# EAGLE design rony_4_buttons (EAGLE 8.2.0)
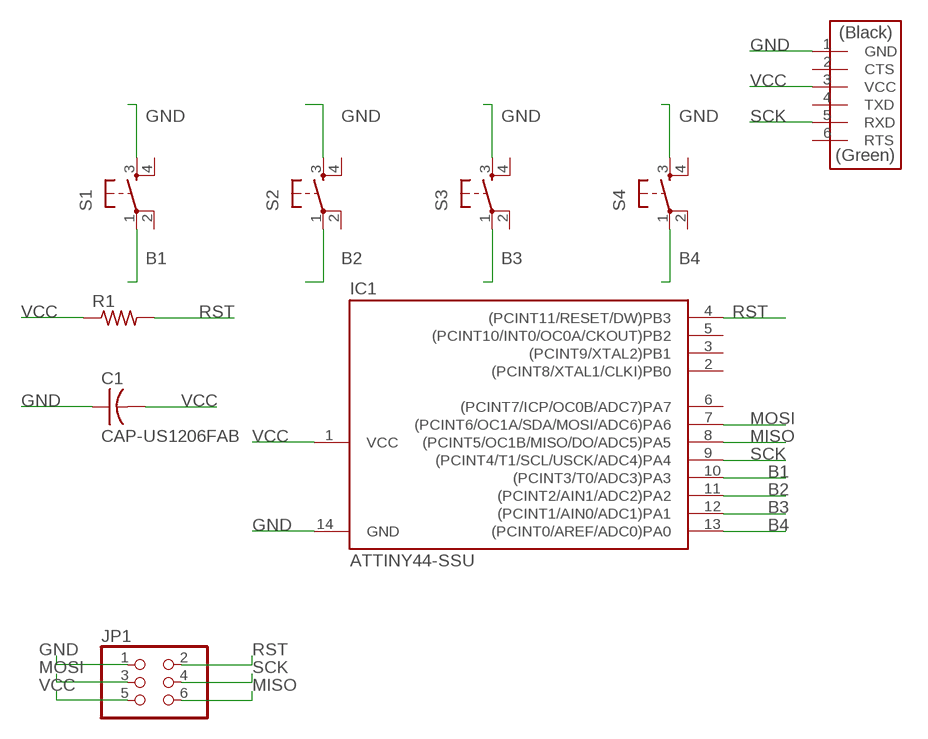
[diagram p0: schematic, sheet 1]

## Parts
C1  CAP-US1206FAB  [C1206FAB]
IC1  ATTINY44-SSU  [SOIC14]
JP1  PINHD-2X3-SMD  [2X03SMD]
R1  RES-US1206FAB  [R1206FAB]
S1  6MM_SWITCH6MM_SWITCH  [6MM_SWITCH]
S2  6MM_SWITCH6MM_SWITCH  [6MM_SWITCH]
S3  6MM_SWITCH6MM_SWITCH  [6MM_SWITCH]
S4  6MM_SWITCH6MM_SWITCH  [6MM_SWITCH]
U$1  FTDI-SMD-HEADER  [1X06SMD]

## Nets
B1: IC1.10((PCINT3/T0/ADC3)PA3) S1.1(P)
B2: IC1.11((PCINT2/AIN1/ADC2)PA2) S2.1(P)
B3: IC1.12((PCINT1/AIN0/ADC1)PA1) S3.1(P)
B4: IC1.13((PCINT0/AREF/ADC0)PA0) S4.1(P)
GND: C1.1 IC1.14(GND) JP1.1 S1.3(S) S2.3(S) S3.3(S) S4.3(S) U$1.1(GND)
MISO: IC1.8((PCINT5/OC1B/MISO/DO/ADC5)PA5) JP1.6
MOSI: IC1.7((PCINT6/OC1A/SDA/MOSI/ADC6)PA6) JP1.3
RST: IC1.4((PCINT11/RESET/DW)PB3) JP1.2 R1.2
SCK: IC1.9((PCINT4/T1/SCL/USCK/ADC4)PA4) JP1.4 U$1.5(RXD)
VCC: C1.2 IC1.1(VCC) JP1.5 R1.1 U$1.3(VCC)
Unconnected: IC1.2((PCINT8/XTAL1/CLKI)PB0) IC1.3((PCINT9/XTAL2)PB1) IC1.5((PCINT10/INT0/OC0A/CKOUT)PB2) IC1.6((PCINT7/ICP/OC0B/ADC7)PA7) S1.2(P1) S1.4(S1) S2.2(P1) S2.4(S1) S3.2(P1) S3.4(S1) S4.2(P1) S4.4(S1) U$1.2(CTS) U$1.4(TXD) U$1.6(RTS)

## Library data of the parts
C1 = fab:CAP-US
IC1 = fab:ATTINY44
JP1 = fab:PINHD-2X3-SMD: PIN HEADER
R1 = fab:RES-US: Resistor (US Symbol) Variants with postfix FAB are widened to allow the routing of internal traces
S1-S4 = fab:6MM_SWITCH: OMRON SWITCH
U$1 = fab:FTDI-SMD-HEADER

## Board
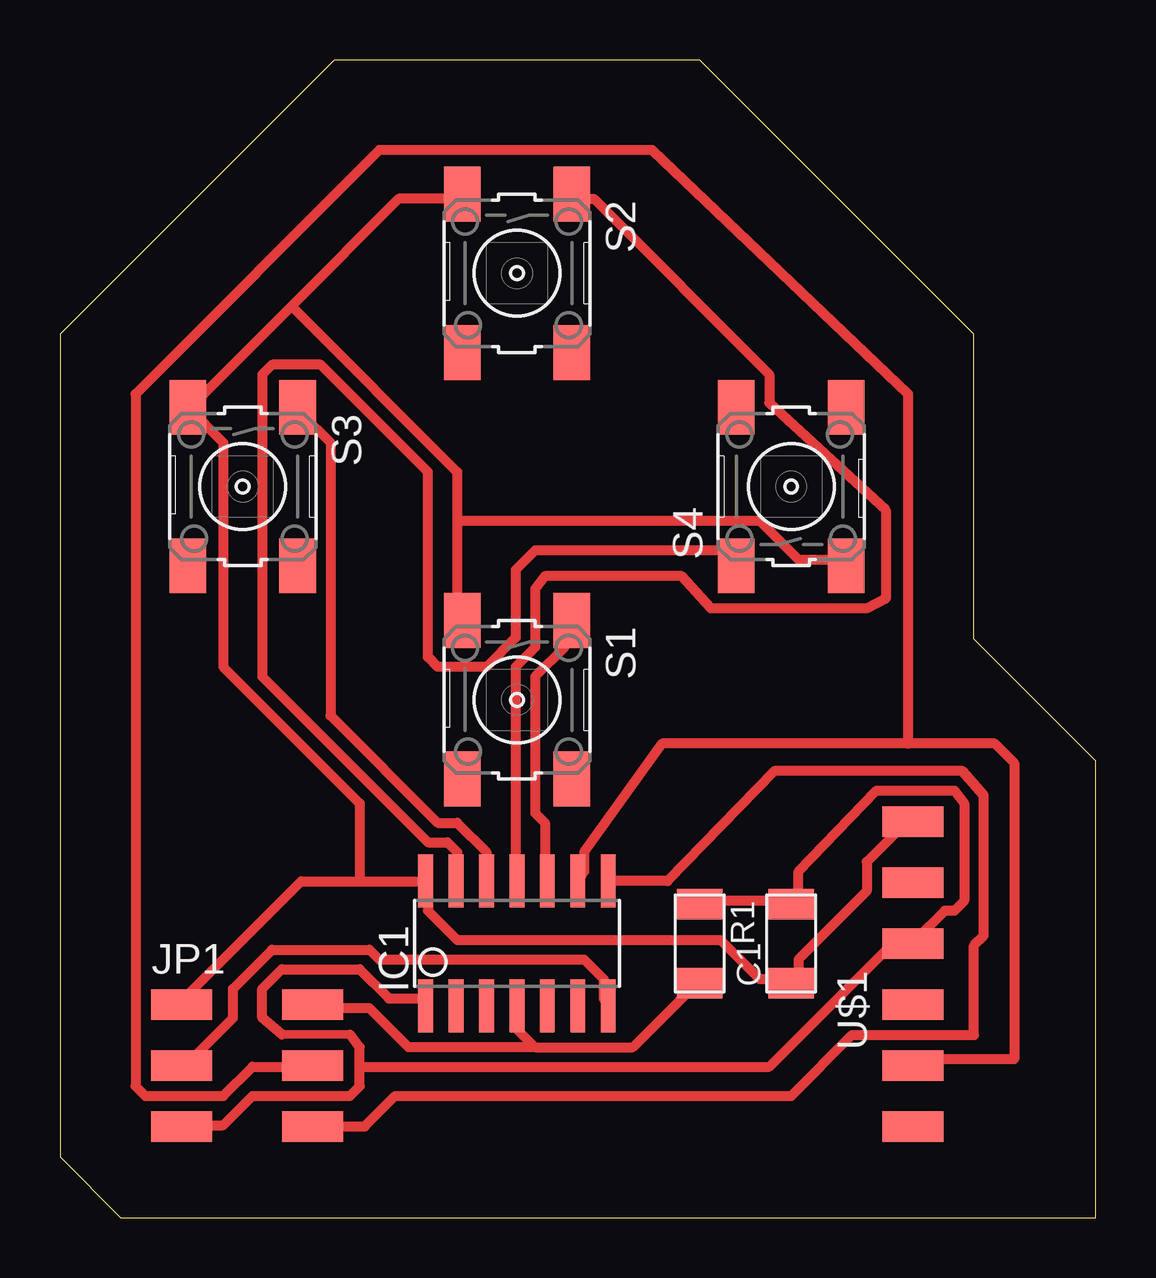
[diagram p1: board, top side]

Size 43.18 x 48.26 mm. Coordinates in mm from the lower left corner, seen from the top.
Outline: 2.54,0 43.18,0 43.18,19.05 38.1,24.13 38.1,36.83 26.67,48.26 11.43,48.26 0,36.83 0,2.54 2.54,0
Copper layers (1*16): Top 0.035mm / dielectric 1.5mm / Bottom 0.035mm
Design rules "guy_output *": minimum track width 16mil, minimum drill 0.35mm, track to track 16mil, track to pad 0.3mm, pad to pad 0.205mm, via to via 0.205mm, smd to smd 6mil, copper to edge 40mil, drill to drill 6mil, minimum pad ring 10mil, minimum via ring 8mil, stop-mask expansion 4mil, vias tented up to drill 0mil, thermal gap 10mil

### Footprints (pad centres in the part's own frame; a part is rotated, then mirrored left to right if it is on the bottom)
C1206FAB = smd 1.27 x 1.905: 1 -1.651,0; 2 1.651,0
SOIC14 = smd 0.61 x 2.21: 1 -3.81,-2.603; 2 -2.54,-2.603; 3 -1.27,-2.603; 4 0,-2.603; 5 1.27,-2.603; 6 2.54,-2.603; 7 3.81,-2.603; 8 3.81,2.603; 9 2.54,2.603; 10 1.27,2.603; 11 0,2.603; 12 -1.27,2.603; 13 -2.54,2.603; 14 -3.81,2.603
2X03SMD = smd 2.54 x 1.27: 1 -2.54,2.54; 2 2.92,2.54; 3 -2.54,0; 4 2.92,0; 5 -2.54,-2.54; 6 2.92,-2.54
R1206FAB = smd 1.27 x 1.905: 1 -1.651,0; 2 1.651,0
6MM_SWITCH = smd 2.286 x 1.524: 1 -3.302,2.286; 2 3.302,2.286; 3 -3.302,-2.286; 4 3.302,-2.286
1X06SMD = smd 2.54 x 1.27: 1 0,6.35; 2 0,3.81; 3 0,1.27; 4 0,-1.27; 5 0,-3.81; 6 0,-6.35

### Placement (x,y rotation side)
C1  30.48,11.43 90 top
IC1  19.05,11.43 0 top
JP1  7.62,6.35 0 top
R1  26.67,11.43 270 top
S1  19.05,21.59 270 top
S2  19.05,39.37 270 top
S3  7.62,30.48 270 top
S4  30.48,30.48 90 top
U$1  35.56,10.16 0 top

### Tracks (layer width: path | path; a pad name or v marks a point on that pad's centre or on a via)
B1
  Top 0.406: IC1.10 20.22,14.43 20.22,16.46 19.81,16.87 19.81,22.55 21.03,23.77 21.03,24.59 S1.1
B2
  Top 0.406: IC1.11 19,14.43 19,22.96 19.81,23.77 19.81,26.21 20.22,26.75 25.91,26.75 27.13,25.4 33.63,25.4 34.42,25.81 34.42,29.49 29.57,33.96 29.57,35.15 22.25,42.47 21.44,42.47 S2.1
B3
  Top 0.406: IC1.12 17.78,15.24 16.56,16.46 15.75,16.46 11.28,20.93 11.28,32.31 10.06,33.53 S3.1
B4
  Top 0.406: IC1.13 16.56,14.43 16.56,15.24 16.15,15.65 15.34,15.65 8.43,22.55 8.43,35.15 8.84,35.56 10.87,35.56 15.34,31.09 15.34,23.37 15.75,22.96 17.78,22.96 19,24.18 19,27 19.81,27.81 27.94,27.81 S4.1
GND
  Top 0.406: U$1.1 35.26,16.46 33.63,14.83 33.63,13.61 30.79,10.77 30.79,9.96 C1.1 30.38,9.96 29.16,9.96 27.53,11.58 16.56,11.58 15.34,12.8 15.34,14.02 | 12.5,14.02 10.06,14.02 5.18,9.14 JP1.1 | 12.5,14.02 15.34,14.02 | 15.34,14.02 IC1.14 | 9.65,38 14.12,42.47 16.56,42.47 S2.3 | 9.65,38 5.59,33.93 S3.3 6.81,32.31 6.81,22.96 12.5,17.27 12.5,14.02 | 16.56,29.06 16.56,31.09 9.65,38 | 16.56,29.06 16.56,24.99 S1.3 | 16.56,29.06 29.16,29.06 30.79,27.43 32.41,27.43 S4.3
MISO
  Top 0.406: JP1.6 12.7,3.81 13.97,5.08 30.48,5.08 33.02,7.62 38.1,7.62 38.1,11.35 38.51,11.76 38.51,17.61 37.62,18.62 29.78,18.62 25.32,14.03 IC1.8
MOSI
  Top 0.406: IC1.7 22.66,9.14 22.66,9.96 21.84,10.77 13.31,10.77 12.9,11.18 8.84,11.18 7.21,9.55 7.21,8.33 5.18,6.3 JP1.3
RST
  Top 0.406: 19.81,7.11 23.88,7.11 26.31,9.55 R1.2 | 19.81,7.11 19,7.93 19,8.74 IC1.4 | 19.81,7.11 14.53,7.11 12.9,8.74 10.87,8.74 JP1.2
SCK
  Top 0.406: 35.36,19.76 38.96,19.76 39.78,18.95 39.78,6.6 35.66,6.6 35.66,6.3 U$1.5 | 35.36,19.76 25.1,19.76 21.84,15.24 21.84,14.43 IC1.9 | 35.36,19.76 35.36,34.34 24.69,44.5 13.31,44.5 3.15,34.34 3.15,5.49 3.56,5.08 6.81,5.08 8.03,6.3 10.46,6.3 JP1.4
VCC
  Top 0.356: 12.09,7.64 9.25,7.64
  Top 0.406: R1.1 26.72,13.21 30.38,13.21 C1.2 30.79,13.21 30.79,14.43 34.04,17.8 37.29,17.8 37.69,17.27 37.69,13.21 37.29,12.8 36.88,12.8 35.66,11.58 U$1.3 35.26,11.18 34.44,11.18 29.57,6.3 12.5,6.3 | 9.25,7.64 8.43,8.33 8.43,9.55 9.25,10.36 12.5,10.36 13.72,9.14 15.34,9.14 IC1.1 | 12.09,7.64 12.5,7.11 12.5,6.3 | 12.5,6.3 12.5,5.49 12.09,5.08 8.03,5.08 6.81,3.86 5.18,3.86 JP1.5